# EAGLE design placa2 (EAGLE 7.6.0)
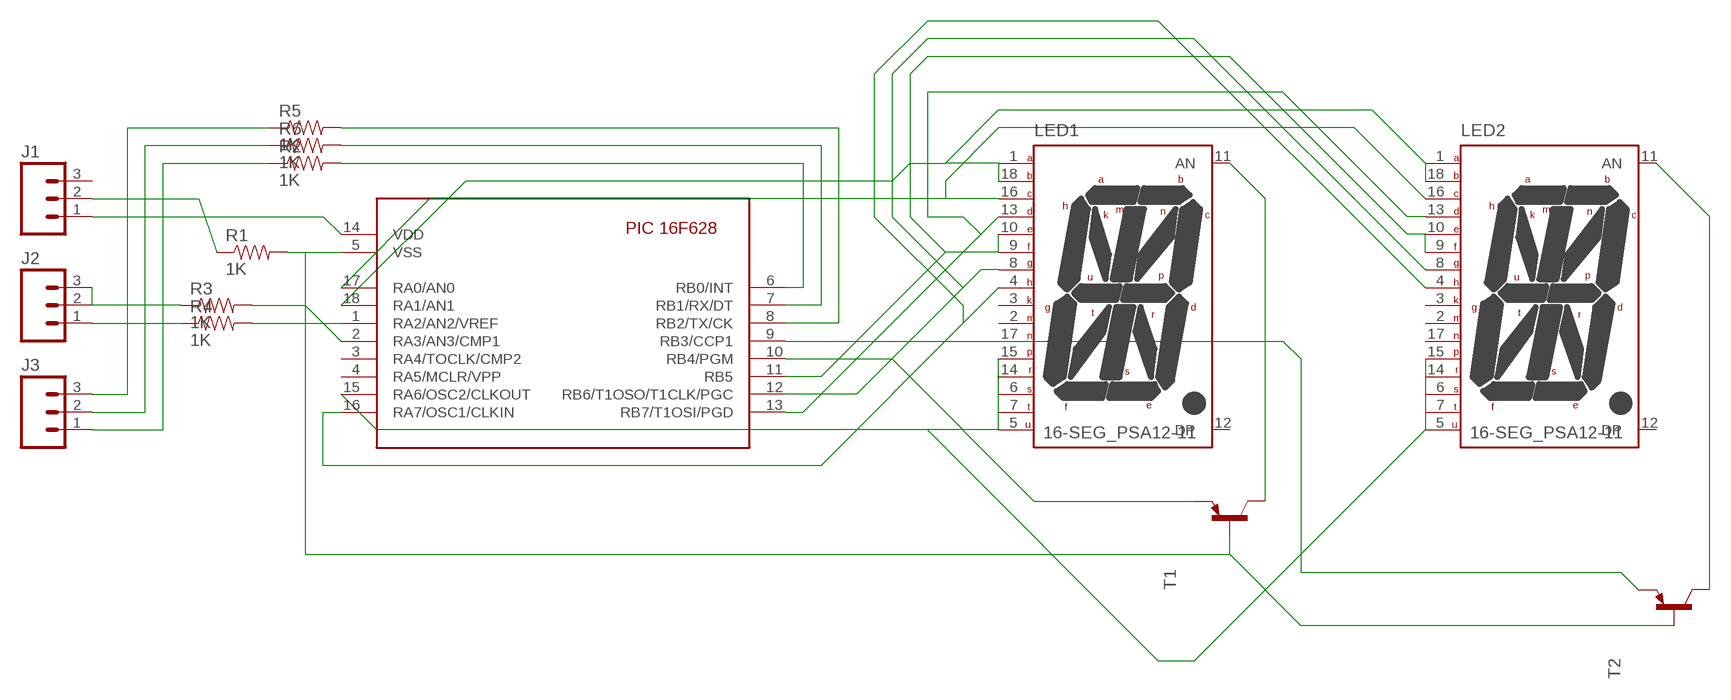
[diagram p0: schematic, sheet 1]

## Parts
J1  M03-SCREW-5MM  [SCREWTERMINAL-5MM-3]
J2  M03-SCREW-5MM  [SCREWTERMINAL-5MM-3]
J3  M03-SCREW-5MM  [SCREWTERMINAL-5MM-3]
LED1  16-SEG_PSA12-11  [PSA12-11]
LED2  16-SEG_PSA12-11  [PSA12-11]
R1  1K  1KOHM-1/4W-1%(PTH)  [AXIAL-0.3]
R2  1K  1KOHM-1/4W-1%(PTH)  [AXIAL-0.3]
R3  1K  1KOHM-1/4W-1%(PTH)  [AXIAL-0.3]
R4  1K  1KOHM-1/4W-1%(PTH)  [AXIAL-0.3]
R5  1K  1KOHM-1/4W-1%(PTH)  [AXIAL-0.3]
R6  1K  1KOHM-1/4W-1%(PTH)  [AXIAL-0.3]
T1  BC558B-PNP-TO92-EBC  [TO92-EBC]
T2  BC558B-PNP-TO92-EBC  [TO92-EBC]
U$1  16F628  [PIC16F628-18-LEAD-PDIP]

## Nets
N$1: J1.1 U$1.14(VDD)
N$2: J1.2 R1.P$1
N$3: J2.1 R4.P$1
N$4: R1.P$2 T1.B T2.B U$1.5(VSS)
N$5: J2.3 R3.P$1
N$6: J3.3 R5.P$1
N$7: R2.P$2 U$1.6(RB0/INT)
N$8: R6.P$2 U$1.7(RB1/RX/DT)
N$9: R5.P$2 U$1.8(RB2/TX/CK)
N$10: LED1.1(A) LED1.18(B) LED2.1(A) LED2.18(B) U$1.18(RA1/AN1)
N$11: LED1.4(H) LED2.4(H) U$1.16(RA7/OSC1/CLKIN)
N$12: LED1.11(AN) T1.C
N$13: LED1.16(C) LED2.16(C) U$1.17(RA0/AN0)
N$14: J3.2 R6.P$1
N$15: LED2.11(AN) T2.C
N$16: J3.1 R2.P$1
N$17: LED1.13(D) LED2.13(D) U$1.13(RB7/T1OSI/PGD)
N$18: LED1.8(G) LED2.8(G) U$1.12(RB6/T1OSO/T1CLK/PGC)
N$19: T1.E U$1.10(RB4/PGM)
N$20: T2.E U$1.9(RB3/CCP1)
N$21: R3.P$2 U$1.2(RA3/AN3/CMP1)
N$22: LED1.5(U) LED1.15(P) LED2.5(U) LED2.15(P) U$1.15(RA6/OSC2/CLKOUT)
N$23: LED1.9(F) LED1.10(E) LED2.9(F) LED2.10(E) U$1.11(RB5)
N$24: R4.P$2 U$1.1(RA2/AN2/VREF)
Unconnected: J1.3 J2.2 LED1.2(M) LED1.3(K) LED1.6(S) LED1.7(T) LED1.12(DP) LED1.14(R) LED1.17(N) LED2.2(M) LED2.3(K) LED2.6(S) LED2.7(T) LED2.12(DP) LED2.14(R) LED2.17(N) U$1.3(RA4/TOCLK/CMP2) U$1.4(RA5/MCLR/VPP)

## Library data of the parts
J1-J3 = SparkFun-Connectors:M03: Header 3 Standard 3-pin 0.1" header. Use with straight break away headers (SKU : PRT-00116), right angle break away headers (PRT-00553), swiss pins (PRT-00743), machine pins (PRT-00117), and female headers (PRT-00115). Molex polarized connector foot print use with SKU : PRT-08232 with associated crimp pins and housings.; STOREFRONT_ID: PRT-08433
LED1 LED2 = display-kingbright:16-SEG_: 16 SEGMENT SINGLE DIGIT ALPHANUMERIC NUMERIC DISPLAY; OC_FARNELL: unknown; OC_NEWARK: unknown
R1-R6 = SparkFun-Resistors:1KOHM-1/4W-1%(PTH): RES-12182; PROD_ID: RES-12182
T1 T2 = transistor:*-PNP-: PNP Transistror
U$1 = pic16f6xx-1:16F628: Microchip component PIC 16F628 Eric Magraner - eric_magraner@yahoo.fr 03/2004

## Net classes
0 default: width 0.8 mm, clearance 0.4 mm

## Board
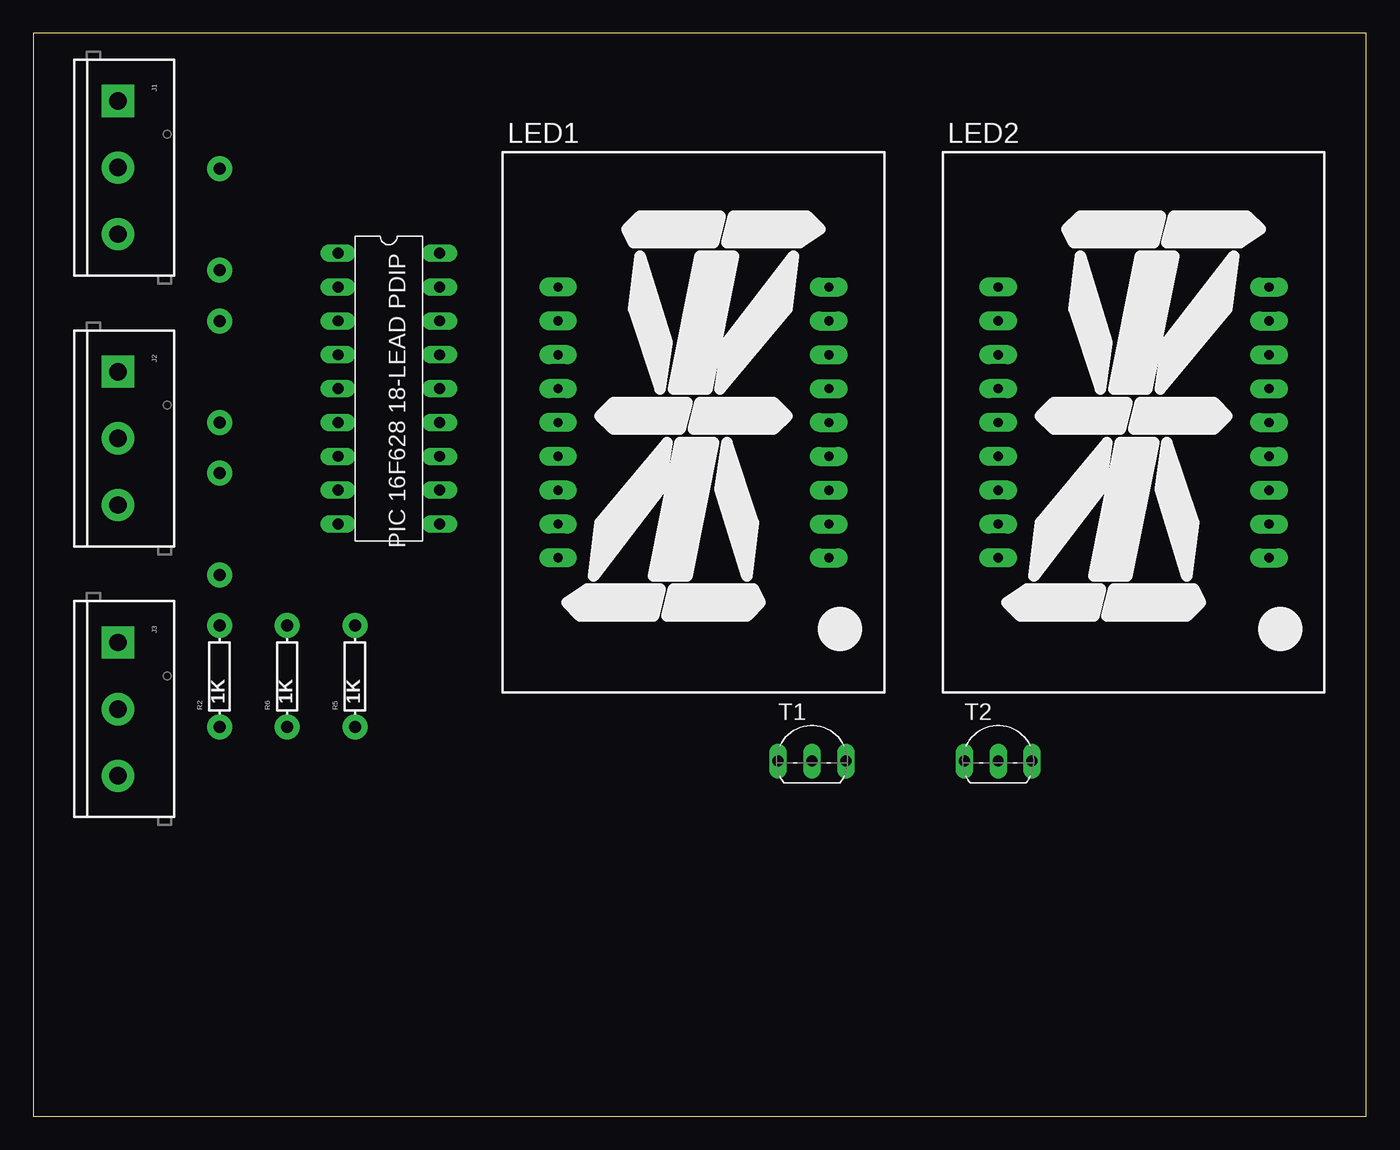
[diagram p1: board, top side]
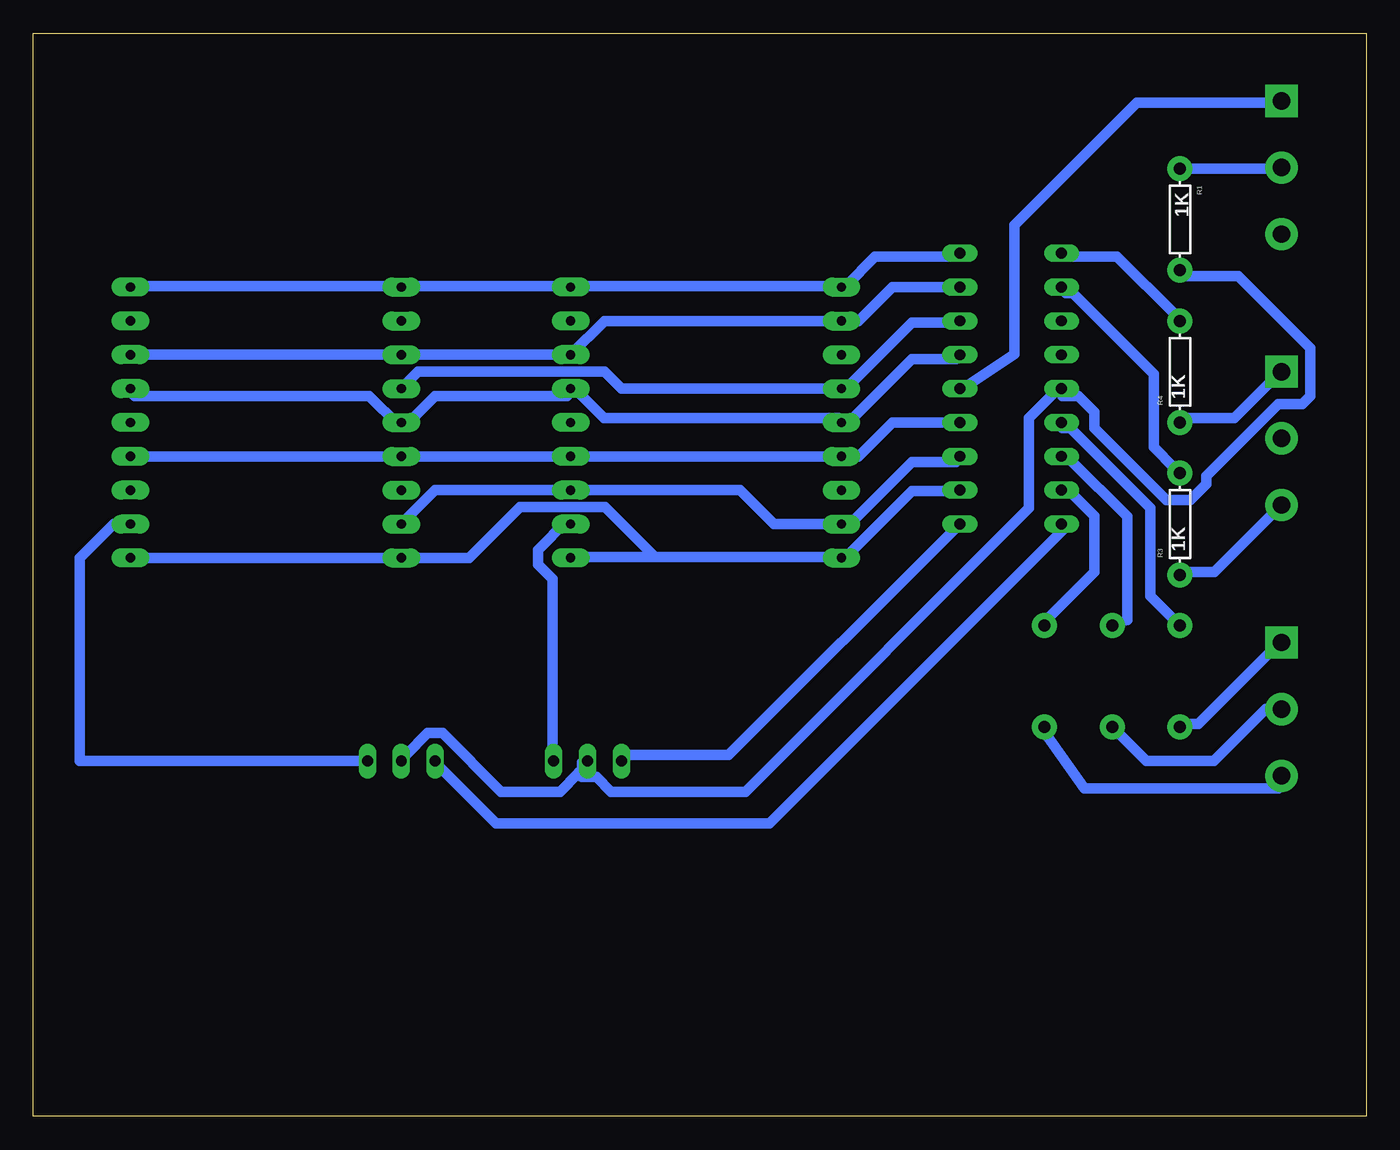
[diagram p2: board, bottom side, seen from below]

Size 100 x 81.27 mm. Coordinates in mm from the lower left corner, seen from the top.
Outline: 0,0 100,0 100,81.27 0,81.27 0,0
Copper layers (1*16): Top 0.035mm / dielectric 1.5mm / Bottom 0.035mm
Design rules "default": minimum track width 10mil, minimum drill 24mil, track to track 8mil, track to pad 8mil, pad to pad 8mil, via to via 8mil, smd to smd 8mil, copper to edge 40mil, drill to drill 8mil, minimum pad ring 10mil, minimum via ring 8mil, stop-mask expansion 4mil, vias tented up to drill 0mil, thermal gap 10mil

### Footprints (pad centres in the part's own frame; a part is rotated, then mirrored left to right if it is on the bottom)
SCREWTERMINAL-5MM-3 = drill 1.3 pad 2.413 square: 1 0,0 | drill 1.3 pad 2.413: 2 5,0; 3 10,0
PSA12-11 = drill 0.7 pad 1.422 long: 1 -10.16,10.16; 2 -10.16,7.62; 3 -10.16,5.08; 4 -10.16,2.54; 5 -10.16,0; 6 -10.16,-2.54; 7 -10.16,-5.08; 8 -10.16,-7.62; 9 -10.16,-10.16; 10 10.16,-10.16; 11 10.16,-7.62; 12 10.16,-5.08; 13 10.16,-2.54; 14 10.16,0; 15 10.16,2.54; 16 10.16,5.08; 17 10.16,7.62; 18 10.16,10.16
AXIAL-0.3 = drill 0.9 pad 1.88: P$1 -3.81,0; P$2 3.81,0
TO92-EBC = drill 0.813 long: B 0,-1.27; C 2.54,-1.27; E -2.54,-1.27
PIC16F628-18-LEAD-PDIP = drill 0.813 long: 1 -10.16,-3.81; 2 -7.62,-3.81; 3 -5.08,-3.81; 4 -2.54,-3.81; 5 0,-3.81; 6 2.54,-3.81; 7 5.08,-3.81; 8 7.62,-3.81; 9 10.16,-3.81; 10 10.16,3.81; 11 7.62,3.81; 12 5.08,3.81; 13 2.54,3.81; 14 0,3.81; 15 -2.54,3.81; 16 -5.08,3.81; 17 -7.62,3.81; 18 -10.16,3.81

### Placement (x,y rotation side)
J1  6.35,76.2 270 top
J2  6.35,55.88 270 top
J3  6.35,35.56 270 top
LED1  49.53,52.07 0 top
LED2  82.55,52.07 0 top
R1  13.97,67.31 270 bottom
R2  13.97,33.02 90 top
R3  13.97,44.45 90 bottom
R4  13.97,55.88 90 bottom
R5  24.13,33.02 90 top
R6  19.05,33.02 90 top
T1  58.42,27.94 0 top
T2  72.39,27.94 0 top
U$1  26.67,54.61 270 top

### Tracks (layer width: path | path; a pad name or v marks a point on that pad's centre or on a via)
N$1
  Bottom 0.8: U$1.14 30.25,54.62 26.4,57.2 26.4,66.89 17.22,76.07 6.6,76.07 J1.1
N$2
  Bottom 0.8: R1.P$1 6.6,71.12 J1.2
N$3
  Bottom 0.8: R4.P$1 13.75,52.42 9.9,52.42 6.6,55.72 J2.1
N$4
  Bottom 0.8: 59.12,25.75 60.5,24.37 64.9,24.37 69.3,28.77 70.4,28.77 72.05,27.12 T2.B | 59.12,25.75 58.85,26.02 58.85,26.57 T1.B | 59.12,25.75 58.85,25.47 57.75,25.47 56.65,24.37 46.58,24.37 25.3,45.65 25.3,52.42 23.1,54.62 U$1.5 22.8,54.07 21.6,54.07 20.4,52.87 20.4,51.67 15,46.27 13.2,46.27 12,47.47 12,48.07 6.6,53.47 4.8,53.47 4.2,54.07 4.2,57.67 9.6,63.07 13.8,63.07 R1.P$2
N$5
  Bottom 0.8: R3.P$1 13.8,40.87 11.4,40.87 6.6,45.67 J2.3
N$6
  Bottom 0.8: R5.P$1 24,28.87 24.14,28.87 21.14,24.6 6.6,24.6 J3.3
N$7
  Bottom 0.8: U$1.6 22.8,51.67 22.2,51.67 16.2,45.67 16.2,39.07 14.4,37.27 R2.P$2
N$8
  Bottom 0.8: U$1.7 22.8,49.27 22.2,49.27 17.93,45 17.93,37.27 R6.P$2
N$9
  Bottom 0.8: U$1.8 22.8,46.87 22.2,46.87 20.4,45.07 20.4,40.87 24,37.27 R5.P$2
N$10
  Bottom 0.8: U$1.18 30.8,64.52 36.85,64.52 39.05,62.32 LED1.1 39.6,62.32 59.4,62.32 LED1.18 59.95,62.32 72.05,62.32 LED2.1 72.6,62.32 92.4,62.32 LED2.18
N$11
  Bottom 0.8: U$1.16 30.8,59.57 34.1,59.57 39.05,54.62 LED1.4 55.88,54.61 57.15,55.88 71.12,55.88 LED2.4
N$12
  Bottom 0.8: T1.C 61.05,27.12 61.05,40.32 62.15,41.42 62.15,42.52 59.95,44.72 LED1.11
N$13
  Bottom 0.8: U$1.17 35.56,62.23 38.1,59.69 57.15,59.69 LED1.16 LED2.16
N$14
  Bottom 0.8: J3.2 7.54,30.56 11.43,26.67 16.51,26.67 R6.P$1
N$15
  Bottom 0.8: T2.C 96.52,26.67 96.52,41.91 93.98,44.45 LED2.11
N$16
  Bottom 0.8: R2.P$1 13.8,29.47 12.6,29.47 6.6,35.47 J3.1
N$17
  Bottom 0.8: LED2.13 LED1.13 38.1,49.53 35.56,52.07 U$1.13
N$18
  Bottom 0.8: U$1.12 30.8,49.12 34.1,49.12 39.05,44.17 LED1.8 44.45,44.45 46.99,46.99 69.85,46.99 LED2.8
N$19
  Bottom 0.8: T1.E 55.55,27.12 47.85,27.12 30.8,44.17 U$1.10
N$20
  Bottom 0.8: U$1.9 23.1,44.17 22.59,44.17 44.76,22 65.28,22 69.85,26.57 T2.E
N$21
  Bottom 0.8: 14.3,48.57 14.4,48.67 | 14.4,48.67 15.95,50.22 15.95,55.72 22,61.77 22.55,61.77 U$1.2 | 14.4,48.67 R3.P$2
N$22
  Bottom 0.8: U$1.15 30.8,56.82 34.1,56.82 39.05,51.87 LED1.5 39.6,52.42 57.2,52.42 59.4,54.62 LED1.15 59.95,54.07 69.85,54.07 72.05,51.87 LED2.5 72.6,51.87 74.8,54.07 92.4,54.07 LED2.15
N$23
  Bottom 0.8: U$1.11 30.8,46.92 34.1,46.92 39.05,41.97 LED1.9 39.6,41.97 53.34,41.97 | 53.34,41.97 59.4,41.97 LED1.10 | LED2.10 LED2.9 67.31,41.91 63.5,45.72 57.09,45.72 53.34,41.97
N$24
  Bottom 0.8: U$1.1 22.55,64.52 18.7,64.52 14.3,60.12 R4.P$2